# Altium schematic sheet det.SchDoc
size 300 x 200 mm; SheetNumber: 1; SheetTotal: 1
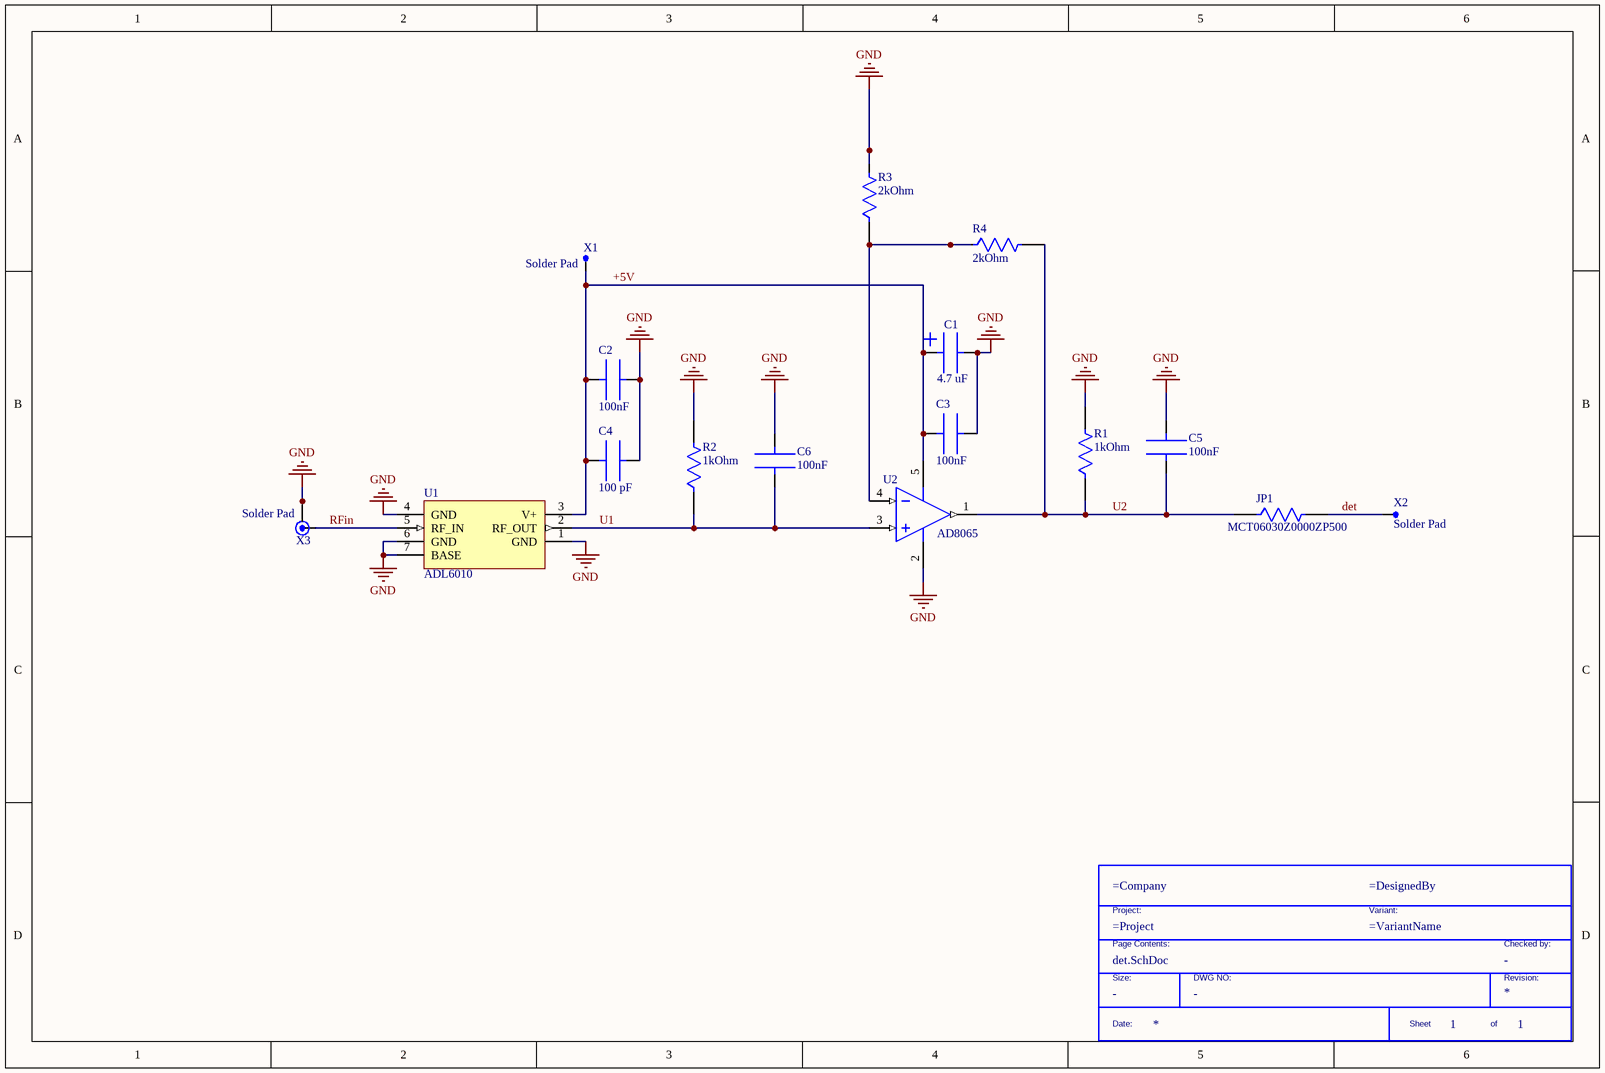
[diagram p0: det.SchDoc]

## Parts
*  TitleBlock  (value not drawn)  (graphical)
C1  4.7 uF  [C4_7uF]
C2  100nF  [C1000pF__C100nF]
C3  100nF  [C1000pF__C100nF]
C4  100 pF  [C100pF]
C5  100nF  [C1000pF__C100nF]
C6  100nF  [C1000pF__C100nF]
JP1  MCT06030Z0000ZP500  [JP_R_MCT06030Z0000ZP500]
R1  1kOhm  [JP_R_MCT06030Z0000ZP500]
R2  1kOhm  [JP_R_MCT06030Z0000ZP500]
R3  2kOhm  [JP_R_MCT06030Z0000ZP500]
R4  2kOhm  [JP_R_MCT06030Z0000ZP500]
U1  ADL6010  [Det_ADL6010ACPZN-R2]
U2  AD8065  [opAmp_AD8065ARTZ-REEL7]
X1  Solder Pad  [Solder Pad]
X2  Solder Pad  [Solder Pad]
X3  Solder Pad  [CPW Edge Connector]

## Nets
GND: C1.2 C2.2 C3.2 C4.2 C5.2 C6.2 R1.2 R2.2 R3.2 U1.1(GND) U1.4(GND) U1.6(GND) U1.7(BASE) U2.2(-VS) X3.2 X3.3
+5V: C1.1(+) C2.1 C3.1 C4.1 U1.3(V+) U2.5(+VS) X1.1
det: JP1.2 X2.1
RFin: U1.5(RF_IN) X3.1
U1: C6.1 R2.1 U1.2(RF_OUT) U2.3(+IN)
U2: C5.1 JP1.1 R1.1 R4.2 U2.1(VOUT)
NetR3_1: R3.1 R4.1 U2.4(-IN)

## Notes on the sheet
- (in symbol TitleBlock) Project:; Variant:; Page Contents:; Checked by:; Size:; DWG NO:; Revision:; Date:; Sheet; of

## Library data of the parts
* = TitleBlock: Standard Title Block; DWG NO: -; Size: -; Checked by: -
C1 = C7_4uF_TH3A475K010C2900: Tantalum Capacitor, Polarized, Tantalum (dry/solid), 10V, 10% +Tol, 10% -Tol, 4.7uF, Surface Mount, 1306; Manufacturer: Vishay Sprague; ESR (Equivalent Series Resistance): 2.9R; Leakage Current: 500nA; Ripple Current: 160mA; Tan Delta: 0.06; Reference Standard: AEC-Q200; Supplier: Future Electronics; Supplier Part Number: 4924098; Manufacturer Part Number: TH3A475K010C2900; RoHS: Yes; Category: Tantalum Capacitors; Stock: 2000; Pricing: 2000=0.178, 4000=0.175, 6000=0.173, 8000=0.171, 10000=0.166 (USD); Mounting Technology: Surface Mount; Pins: 2; Dielectric Material: Tantalum; Package Shape: Rectangular; Case/Package: 1206; Terminal Finish: Tin; Min Operating Temperature: -55°C; Max Operating Temperature: 150°C; JESD-609 Code: e3; Polarity: Polarized; Value: 4.7uF; Capacitor Type: Tantalum; Tolerance  (fill in as +-): 10%; Package Style: SMTMeter; Packaging: Tape and Reel; Tolerance (fill in as +-): 10%; Rated DC Voltage (URdc): 10V; Termination: J BEND; Length: 3.2mm; Width: 1.6mm; Height: 1.6mm; Reach SVHC Compliant: Yes; RoHS Compliant: Yes; ComponentLink1URL: https://datasheet.ciiva.com:443/pdfs/VipMasterIC/IC/VISH/VISH-S-A0010085390/VISH-S-A0010085390-1.pdf?src-supplier=IHS+Markit; ComponentLink1Description: https://datasheet.ciiva.com:443/pdfs/VipMasterIC/IC/VISH/VISH-S-A0010085390/VISH-S-A0010085390-1.pdf?src-supplier=IHS+Markit; ComponentLink2URL: https://datasheet.ciiva.com/268/th3-268785.pdf?src-supplier=Digikey; ComponentLink2Description: https://datasheet.ciiva.com/268/th3-268785.pdf?src-supplier=Digikey; ComponentLink3URL: https://datasheet.ciiva.com/16360/th3-16360891.pdf?src-supplier=Future+Electronics; ComponentLink3Description: https://datasheet.ciiva.com/16360/th3-16360891.pdf?src-supplier=Future+Electronics
C2 C3 C5 C6 = C100nF_GCM188R71C104KA37J: Ceramic Capacitor, Multilayer, Ceramic, 16V, 10% +Tol, 10% -Tol, X7R, 15% TC, 0.1uF, Surface Mount, 0603; Manufacturer: Murata; Multilayer: Yes; Reference Standard: AEC-Q200; Supplier: Mouser; Supplier Part Number: 81-GCM188R71C104KA7J; Manufacturer Part Number: GCM188R71C104KA37J; RoHS: Yes; Category: Ceramic Capacitors; Stock: 1116664; Pricing: 1=0.17, 10=0.097, 50=0.097, 100=0.063, 1000=0.044, 10000=0.031 (USD); Mounting Technology: Surface Mount; Pins: 2; Dielectric Material: Ceramic; Package Shape: Rectangular; Case/Package: 0603; Terminal Finish: Nickel; Min Operating Temperature: -55°C; Max Operating Temperature: 125°C; JESD-609 Code: e3; Value: 100nF; Capacitor Type: Ceramic; Tolerance  (fill in as +-): 10%; Package Style: SMTMeter; Packaging: Tape and Reel; Tolerance (fill in as +-): 10%; Rated DC Voltage (URdc): 16V; Temperature Characteristics Code: X7R; Termination: Wraparound; Length: 1.6mm; Width: 0.8mm; Height: 0.9mm; Reach SVHC Compliant: Yes; RoHS Compliant: Yes; ComponentLink1URL: https://datasheet.ciiva.com:443/pdfs/VipMasterIC/IC/MURE/MURE-S-A0004370842/MURE-S-A0004371613-1.pdf?src-supplier=IHS+Markit; ComponentLink1Description: https://datasheet.ciiva.com:443/pdfs/VipMasterIC/IC/MURE/MURE-S-A0004370842/MURE-S-A0004371613-1.pdf?src-supplier=IHS+Markit; ComponentLink2URL: https://datasheet.ciiva.com/18183/getdatasheetpartid-140967-18183600.pdf?src-supplier=Verical; ComponentLink2Description: https://datasheet.ciiva.com/18183/getdatasheetpartid-140967-18183600.pdf?src-supplier=Verical; ComponentLink3URL: https://datasheet.ciiva.com/29540/product-29540843.pdf?src-supplier=Digikey; ComponentLink3Description: https://datasheet.ciiva.com/29540/product-29540843.pdf?src-supplier=Digikey; ComponentLink4URL: https://datasheet.ciiva.com/29540/product-29540844.pdf?src-supplier=Digikey; ComponentLink4Description: https://datasheet.ciiva.com/29540/product-29540844.pdf?src-supplier=Digikey; ComponentLink5URL: https://datasheet.ciiva.com/29540/product-29540842.pdf?src-supplier=Digikey; ComponentLink5Description: https://datasheet.ciiva.com/29540/product-29540842.pdf?src-supplier=Digikey
C4 = C100pF_GRM1555C2A101FA01D: Multilayer Ceramic Capacitors MLCC - SMD/SMT 100 pF 100 VDC 1% 0402 C0G (NP0); Manufacturer: Murata; Supplier: Mouser; Supplier Part Number: 81-GRM1555C2A11FA1D; Manufacturer Part Number: GRM1555C2A101FA01D; RoHS: No; Stock: 21646; Pricing: 1=0.18, 10=0.119, 50=0.119, 100=0.06, 1000=0.039, 10000=0.035 (USD)
JP1 = JP_small_MCT06030Z0000ZP500: Fixed Resistor, Thin Film, 0.1W, 0ohm, Surface Mount, 0603; Manufacturer: Vishay Beyschlag; Power: 100mW; Rated Temperature: 70°C; Value: 0R; Package Height: 0.45mm; Package Length: 1.55mm; Package Width: 0.85mm; Reference Standard: CECC40401-801; Supplier: Mouser; Supplier Part Number: 594-MCT06030Z0000ZP5; Manufacturer Part Number: MCT06030Z0000ZP500; RoHS: Yes; Category: Chip SMD Resistors; Stock: 102669; Pricing: 1=0.24, 10=0.09, 50=0.09, 100=0.063, 1000=0.04, 10000=0.028 (USD); Mounting Technology: Surface Mount; Pins: 2; Package Shape: Rectangular; Case/Package: 0603; Terminal Finish: Nickel; Min Operating Temperature: -55°C; Max Operating Temperature: 125°C; JESD-609 Code: e3; Resistor Type: FIXED RESISTOR; Construction: Rectangular; Packaging: Tape and Reel; Technology: THIN FILM; Termination: Wraparound; Reach SVHC Compliant: Yes; RoHS Compliant: Yes; ComponentLink1URL: https://datasheet.ciiva.com:443/pdfs/VipMasterIC/IC/VISH/VISH-S-A0002473667/VISH-S-A0002473667-1.pdf?src-supplier=IHS+Markit; ComponentLink1Description: https://datasheet.ciiva.com:443/pdfs/VipMasterIC/IC/VISH/VISH-S-A0002473667/VISH-S-A0002473667-1.pdf?src-supplier=IHS+Markit; ComponentLink2URL: https://datasheet.ciiva.com/48524/mc-pro-48524221.pdf?src-supplier=Avnet; ComponentLink2Description: https://datasheet.ciiva.com/48524/mc-pro-48524221.pdf?src-supplier=Avnet; ComponentLink3URL: https://datasheet.ciiva.com/8901/mc-pro-8901833.pdf?src-supplier=Avnet; ComponentLink3Description: https://datasheet.ciiva.com/8901/mc-pro-8901833.pdf?src-supplier=Avnet; ComponentLink4URL: https://datasheet.ciiva.com/8898/mc-pro-8898078.pdf?src-supplier=Avnet; ComponentLink4Description: https://datasheet.ciiva.com/8898/mc-pro-8898078.pdf?src-supplier=Avnet; ComponentLink5URL: https://datasheet.ciiva.com/2471/mc-pro-2471991.pdf?src-supplier=Digikey; ComponentLink5Description: https://datasheet.ciiva.com/2471/mc-pro-2471991.pdf?src-supplier=Digikey; ComponentLink6URL: https://datasheet.ciiva.com/2471/mc-pro-2471992.pdf?src-supplier=Digikey; ComponentLink6Description: https://datasheet.ciiva.com/2471/mc-pro-2471992.pdf?src-supplier=Digikey; ComponentLink7URL: https://datasheet.ciiva.com/2471/mc-pro-2471993.pdf?src-supplier=Digikey; ComponentLink7Description: https://datasheet.ciiva.com/2471/mc-pro-2471993.pdf?src-supplier=Digikey; ComponentLink8URL: https://datasheet.ciiva.com/16451/mc-pro-16451398.pdf?src-supplier=Future+Electronics; ComponentLink8Description: https://datasheet.ciiva.com/16451/mc-pro-16451398.pdf?src-supplier=Future+Electronics
R1-R4 = R_1kOhm_MCT06030C1001FPW00: Fixed Resistor, Thin Film, 0.1W, 1000ohm, 75V, 1% +/-Tol, 50ppm/Cel, Surface Mount, 0603; Manufacturer: Vishay BCcomponents; Power: 100mW; Rated Temperature: 70°C; Value: 1kR; Temperature Coefficient (ppm/Cel): 50; Package Height: 0.45mm; Package Length: 1.55mm; Package Width: 0.85mm; Reference Standard: CECC40401-801; Supplier: Mouser; Supplier Part Number: 594-MCT06030C1001FPW; Manufacturer Part Number: MCT06030C1001FPW00; RoHS: Yes; Category: Chip SMD Resistors; Stock: 43742; Pricing: 1=0.1, 10=0.039, 50=0.039, 100=0.035, 1000=0.021, 10000=0.014 (USD); Mounting Technology: Surface Mount; Pins: 2; Package Shape: Rectangular; Case/Package: 0603; Terminal Finish: Nickel; Min Operating Temperature: -55°C; Max Operating Temperature: 125°C; Tolerance: 1%; JESD-609 Code: e3; Resistor Type: FIXED RESISTOR; Construction: Rectangular; Packaging: Tape and Reel; Technology: THIN FILM; Termination: Wraparound; Working Voltage: 75V; Reach SVHC Compliant: Yes; RoHS Compliant: Yes; ComponentLink1URL: https://datasheet.ciiva.com:443/pdfs/VipMasterIC/IC/VISH/VISH-S-A0002473667/VISH-S-A0002473667-1.pdf?src-supplier=IHS+Markit; ComponentLink1Description: https://datasheet.ciiva.com:443/pdfs/VipMasterIC/IC/VISH/VISH-S-A0002473667/VISH-S-A0002473667-1.pdf?src-supplier=IHS+Markit; ComponentLink2URL: http://components.arrow.com/part/dataview/43585914S9217422N4052?src-supplier=Arrow+Electronics; ComponentLink2Description: http://components.arrow.com/part/dataview/43585914S9217422N4052?src-supplier=Arrow+Electronics; ComponentLink3URL: https://datasheet.octopart.com/MCT06030C1001FPW00-Vishay-datasheet-81842982.pdf?src-supplier=Future+Electronics; ComponentLink3Description: https://datasheet.octopart.com/MCT06030C1001FPW00-Vishay-datasheet-81842982.pdf?src-supplier=Future+Electronics
U1 = det_ADL6010ACPZN-R2: Linear Detector, 500MHz Min, 43500MHz Max, 20dBm Input Power-Max; Manufacturer: Analog Devices; Supplier: Mouser; Supplier Part Number: 584-ADL6010ACPZN-R2; Manufacturer Part Number: ADL6010ACPZN-R2; RoHS: Yes; Category: RF Semiconductors and Devices; Stock: 808; Pricing: 1=162.98, 10=153.49, 50=153.49, 100=153.49, 1000=153.49, 10000=153.49 (USD); RF/Microwave Device Type: LINEAR DETECTOR; Reach SVHC Compliant: Yes; RoHS Compliant: Yes; ComponentLink1URL: https://datasheet.ciiva.com:443/pdfs/VipMasterIC/IC/ANDI/ANDI-S-A0008998713/ANDI-S-A0008998713-1.pdf?src-supplier=IHS+Markit; ComponentLink1Description: https://datasheet.ciiva.com:443/pdfs/VipMasterIC/IC/ANDI/ANDI-S-A0008998713/ANDI-S-A0008998713-1.pdf?src-supplier=IHS+Markit; ComponentLink2URL: https://datasheet.ciiva.com/29985/adl6010-29985760.pdf?src-supplier=Avnet; ComponentLink2Description: https://datasheet.ciiva.com/29985/adl6010-29985760.pdf?src-supplier=Avnet
U2 = opAmp_AD8065ARTZ-REEL7: Operational Amplifier, 1 Func, BIPolar, PDSO5; Manufacturer: Analog Devices; Package Body Material: Plastic; Bandwidth-Nom: 145MHz; Consumer IC Type: VIDEO AMPLIFIER; Number of Channels: 1; Max Supply Voltage: 12V; Min Supply Voltage: 2.5V; Time @ Peak Reflow Temperature-Max (s): 40s; Qualification Status: Not Qualified; Supplier: Mouser; Supplier Part Number: 584-AD8065ARTZ-R7; Manufacturer Part Number: AD8065ARTZ-REEL7; RoHS: Yes; Category: Amplifiers - Op Amps, Buffer, Instrumentation; Stock: 85532; Pricing: 1=6.36, 10=3.77, 50=3.77, 100=3.13, 1000=2.6, 10000=2.59 (USD); Case/Package: LSSOP; Pins: 5; Package Shape: Rectangular; Terminal Finish: Tin; Min Operating Temperature: -40°C; Max Operating Temperature: 85°C; JESD-609 Code: e3; JESD-30 Code: R-PDSO-G5; Moisture Sensitivity Level: 1; Channels: 1; Package Style: SMALL OUTLINE, LOW PROFILE, SHRINK PITCHMeter; Peak Reflow Temperature (Cel): 260°C; Surface Mount: Yes; Technology: BIPOLAR; Terminal Form: Gull Wing; Terminal Position: DUAL; Length: 2.9mm; Width: 1.6mm; Height - Seated (Max): 1.45mm; Terminal Pitch: 0.95mm; Temperature Grade: INDUSTRIAL; Reach SVHC Compliant: Yes; RoHS Compliant: Yes; ComponentLink1URL: https://datasheet.ciiva.com:443/pdfs/VipMasterIC/IC/ANDI/ANDI-S-A0007455537/ANDI-S-A0007455537-1.pdf?src-supplier=IHS+Markit; ComponentLink1Description: https://datasheet.ciiva.com:443/pdfs/VipMasterIC/IC/ANDI/ANDI-S-A0007455537/ANDI-S-A0007455537-1.pdf?src-supplier=IHS+Markit; ComponentLink2URL: https://datasheet.ciiva.com/1794/ad8065-8066-1794192.pdf?src-supplier=Digikey; ComponentLink2Description: https://datasheet.ciiva.com/1794/ad8065-8066-1794192.pdf?src-supplier=Digikey; ComponentLink3URL: https://datasheet.ciiva.com/46387/1906158-46387195.pdf?src-supplier=Element14; ComponentLink3Description: https://datasheet.ciiva.com/46387/1906158-46387195.pdf?src-supplier=Element14; ComponentLink4URL: https://datasheet.ciiva.com/8078/1906158-8078715.pdf?src-supplier=Element14; ComponentLink4Description: https://datasheet.ciiva.com/8078/1906158-8078715.pdf?src-supplier=Element14; ComponentLink5URL: https://datasheet.ciiva.com/28388/1906158-28388634.pdf?src-supplier=Element14; ComponentLink5Description: https://datasheet.ciiva.com/28388/1906158-28388634.pdf?src-supplier=Element14; ComponentLink6URL: https://datasheet.ciiva.com/1794/ad8065-8066-1794191.pdf?src-supplier=Digikey; ComponentLink6Description: https://datasheet.ciiva.com/1794/ad8065-8066-1794191.pdf?src-supplier=Digikey; ComponentLink7URL: https://datasheet.ciiva.com/1794/ad8065-8066-1794193.pdf?src-supplier=Digikey; ComponentLink7Description: https://datasheet.ciiva.com/1794/ad8065-8066-1794193.pdf?src-supplier=Digikey; ComponentLink8URL: https://datasheet.ciiva.com/2972/ad8065-8066-2972973.pdf?src-supplier=Avnet; ComponentLink8Description: https://datasheet.ciiva.com/2972/ad8065-8066-2972973.pdf?src-supplier=Avnet; ComponentLink9URL: https://datasheet.ciiva.com/15410/ad8065-8066-246489-15410250.pdf?src-supplier=Mouser; ComponentLink9Description: https://datasheet.ciiva.com/15410/ad8065-8066-246489-15410250.pdf?src-supplier=Mouser; ComponentLink10URL: https://datasheet.ciiva.com/48709/001248924-da-01-en-ic-opamp-v-ad8065artz-reel7-sot-23-5-adi-48709574.pdf?src-supplier=Conrad; ComponentLink10Description: https://datasheet.ciiva.com/48709/001248924-da-01-en-ic-opamp-v-ad8065artz-reel7-sot-23-5-adi-48709574.pdf?src-supplier=Conrad
X1 X2 = Solder Pad: Pad to solder wires to
X3 = RF  CPW Solder Pad: Solder pad for RF Coplanar Waveguide Rogers 4350B Thickness 0.020" Copper 1oz